# Altium schematic sheet Power supply.SchDoc
size A; SheetNumber: 1; SheetTotal: 1
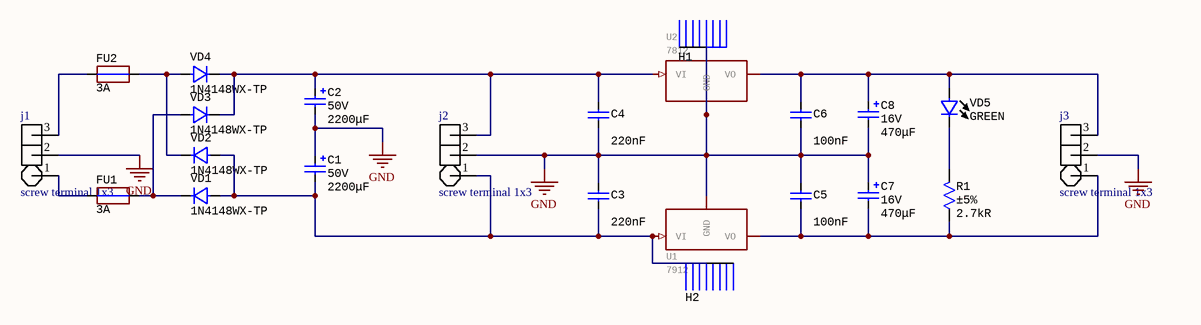
[diagram p0: Power supply.SchDoc]

## Parts
C1  value 2200μF  Voltage: 50V  [CAP Electrolytic TH D16C7.5H31.5]
C2  value 2200μF  Voltage: 50V  [CAP Electrolytic TH D16C7.5H31.5]
C3  value 220nF  [CAP Ceramic TH AY2102M29Y5US63L7]
C4  value 220nF  [CAP Ceramic TH AY2102M29Y5US63L7]
C5  value 100nF  [CAP Ceramic TH AY2102M29Y5US63L7]
C6  value 100nF  [CAP Ceramic TH AY2102M29Y5US63L7]
C7  value 470μF  Voltage: 16V  [CAP Electrolytic TH D10C5H12.5]
C8  value 470μF  Voltage: 16V  [CAP Electrolytic TH D10C5H12.5]
FU1  MaxCurrent: 3A  [FUSE TH BLX-A]
FU2  MaxCurrent: 3A  [FUSE TH BLX-A]
H1  Heatsink 1 pad transistor TO220  [Heatsink 1 pad SK95-2M3]  (value not drawn)
H2  Heatsink 1 pad transistor TO220  [Heatsink 1 pad SK95-2M3]  (value not drawn)
j1  screw terminal 1x3  [screw terminal 1x3]
j2  screw terminal 1x3  [screw terminal 1x3]
j3  screw terminal 1x3  [screw terminal 1x3]
R1  value 2.7kR  Tolerance: ±5%  [RES TH 0.25W H 0207$10]
U1  7912  [Linear reagulator TH TO220V]
U2  7812  [Linear reagulator TH TO220V]
VD1  PartNumber: 1N4148WX-TP  [Diode TH DO-41 (h) (1n4007)]
VD2  PartNumber: 1N4148WX-TP  [Diode TH DO-41 (h) (1n4007)]
VD3  PartNumber: 1N4148WX-TP  [Diode TH DO-41 (h) (1n4007)]
VD4  PartNumber: 1N4148WX-TP  [Diode TH DO-41 (h) (1n4007)]
VD5  Color: GREEN  [LED TH 5MM]

## Nets
GND: C1.1 C2.2 C3.1 C4.2 C5.1 C6.2 C7.1 C8.2 H1.1(S) j1.2 j2.2 j3.2 U1.1(GND) U2.2(GND)
NetC1_2: C1.2 C3.2 H2.1(S) j2.1 U1.2(VI) VD1.1 VD2.1
NetC2_1: C2.1 C4.1 j2.3 U2.1(VI) VD3.2 VD4.2
NetC5_2: C5.2 C7.2 j3.1 R1.1 U1.3(VO)
NetC6_1: C6.1 C8.1 j3.3 U2.3(VO) VD5.1
NetFU1_1: FU1.1 j1.1
NetFU1_2: FU1.2 VD1.2 VD3.1
NetFU2_1: FU2.1 j1.3
NetFU2_2: FU2.2 VD2.2 VD4.1
NetR1_2: R1.2 VD5.2

## Library data of the parts
C1 C2 = Capacitor Aluminium: Manufacturer: Wurth; PartNumber: 860080475013; ValueManufacturerPartNumber: Aluminium capacitor, 2200μF, 50V, ±20%, 54mOhm, 14x10x5 mm, -55...+105°C; TypeCapacitor: Aluminium capacitor; Tolerance: ±20%; Impedance: 54mOhm; Package: 14x10x5 mm; HelpURL: https://www.digikey.com/product-detail/en/wurth-electronics-inc/860080475013/732-9029-1-ND/5728972; Temperature: -55...+105°C
C3 C4 = Capacitor Film: Manufacturer: Epcos; PartNumber: B32774D4106K000; ValueManufacturerPartNumber: Film capacitor, 220nF, 450VDC, ±10%, 10.9mOhm, 31.5x15 mm, -40...+105°C; TypeCapacitor: Film capacitor; Tolerance: ±10%; Impedance: 10.9mOhm; Voltage: 450VDC; Package: 31.5x15 mm; HelpURL: https://www.digikey.com/products/en/capacitors/film-capacitors/62?k=&pkeyword=&sv=0&pv2097=1958&sf=0&FV=fffc01ef%2C1f140000%2Cffe0003e%2Cffec6366&quantity=1&ColumnSort=1000011&page=1&stock=1&pageSize=25; Temperature: -40...+105°C
C5 C6 = Capacitor Film: Manufacturer: Epcos; PartNumber: B32774D4106K000; ValueManufacturerPartNumber: Film capacitor, 100nF, 450VDC, ±10%, 10.9mOhm, 31.5x15 mm, -40...+105°C; TypeCapacitor: Film capacitor; Tolerance: ±10%; Impedance: 10.9mOhm; Voltage: 450VDC; Package: 31.5x15 mm; HelpURL: https://www.digikey.com/products/en/capacitors/film-capacitors/62?k=&pkeyword=&sv=0&pv2097=1958&sf=0&FV=fffc01ef%2C1f140000%2Cffe0003e%2Cffec6366&quantity=1&ColumnSort=1000011&page=1&stock=1&pageSize=25; Temperature: -40...+105°C
C7 C8 = Capacitor Aluminium: Manufacturer: Wurth; PartNumber: 860080475013; ValueManufacturerPartNumber: Aluminium capacitor, 470μF, 16V, ±20%, 54mOhm, 14x10x5 mm, -55...+105°C; TypeCapacitor: Aluminium capacitor; Tolerance: ±20%; Impedance: 54mOhm; Package: 14x10x5 mm; HelpURL: https://www.digikey.com/product-detail/en/wurth-electronics-inc/860080475013/732-9029-1-ND/5728972; Temperature: -55...+105°C
FU1 FU2 = Fuse: Manufacturer: Littelfuse; PartNumber: 01110501Z; TypeFuse: Electromechanics relay; VoltageMax: 250VAC; Package: 5x20mm; HelpURL: https://www.digikey.com/products/en?keywords=01110501Z; ValueManufacturerPartNumber: =TypeFuse+', '+VoltageMax+', '+MaxCurrent+', '+Package+', '+Temperature
j1-j3 = screw terminal 1x3: PCB Terminal Block 3 Poles, 5 mm Pitch, 691101710003, Würth Elektronik; Manufacturer: Wurth Electronics; Plating: Steel; Number of Levels: 1; Number of Positions Per Level: 3; Current: 16A; Voltage: 250V; Wire Gauge (Max): 26AWG; Wire Gauge (Min): 14AWG; Pitch: 0.197inch; Stripping Length: -7mm; Supplier 1: Digi-Key; Manufacturer Part Number: 691101710003; RoHS: Yes; Category: Terminal Blocks; Stock 1: 955; Pricing 1: 1=0.96000, 10=0.86200, 50=0.74500, 100=0.69120 (USD); Mount: Through Hole; Color: Blue; Housing Material: PA66; Contact Material: Brass; Contact Plating: Tin; Min Operating Temperature: -40°C; Max Operating Temperature: 105°C; Packaging: Bulk; Termination: Screw; Package Quantity: 400; Number of Contacts: 3; Series: WR-TBL Series 101; Voltage Rating: 250V; Current Rating: 16A; Length: 9mm; Width: 16.2mm; Height: 16.4mm; Wire/Cable Gauge: 26AWG; REACH SVHC: Unknown; RoHS Compliant: Yes; ComponentLink1URL: https://datasheet.ciiva.com/824/6911017100xx-824072.pdf?src-supplier=Digi-Key; ComponentLink1Description: https://datasheet.ciiva.com/824/6911017100xx-824072.pdf?src-supplier=Digi-Key; Supplier Part Number 1: 732-2027-ND
R1 = Resistor Fixed: Manufacturer: Yageo; PartNumber: RC0201JR-07100RL; ValueManufacturerPartNumber: Resistor film, 2.7kR, ±5%, 0201, 0.25W, -55...+125°C; TypeResistor: Resistor film; Power: 0.25W; Package: 0201; HelpURL: https://www.digikey.com/product-detail/en/yageo/RC0201JR-07100RL/311-100NCT-ND/1949006; Temperature: -55...+125°C
U1 = 79XX: Negative VOLTAGE REGULATOR; GateName_1: A1; DeviceName: H; DeviceSetName: 79*; POPULARITY: 0; SymbolName_1: 79XX; LibraryName: Linear regulator; Package: TO39
U2 = 78XX: Positive VOLTAGE REGULATOR; GateName_1: A1; DeviceName: DT; DeviceSetName: 78*; POPULARITY: 0; SymbolName_1: 78XX; LibraryName: Linear regulator; Package: TO252
VD1-VD4 = Diode single: Manufacturer: Micro Commercial; ValueManufacturerPartNumber: Single diode, 75V, 150mA, 1V, 4ns, SOD-323, -55...+150°C; TypeDiode: Single diode; Voltage: 75V; Current: 150mA; VoltageDrop: 1V; RecoveryTime: 4ns; Package: SOD-323; HelpURL: https://www.digikey.com/product-detail/en/micro-commercial-co/1N4148WX-TP/1N4148WXTPMSCT-ND/717312; Temperature: -55...+150°C
VD5 = LED single: ValueManufacturerPartNumber: LED, Green, *, *, *, -55...+150°C; TypeDiode: LED; Manufacturer: *; Package: *; HelpURL: *; Temperature: -55...+150°C; Current: *; VoltageDrop: *; PartNumber: *; ColorParameter: Green